# Altium project Twintig-FFC-Metacarpal-RA.PrjPcb
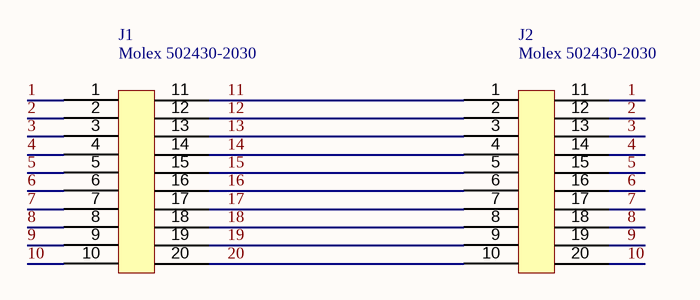
[diagram p0: Twintig-FFC-Metacarpal-RA.SchDoc]
Version: v1.0.2; Project: Twintig FCC Metacarpal RA; Author: Seb Madgwick
1 sheet, 2 parts. Net scope: global (net labels, ports and power ports of the same name join across sheets).
Board file: Twintig-FFC-Metacarpal-RA.PcbDoc

## Sheet Twintig-FFC-Metacarpal-RA.SchDoc
size A4; SheetNumber: 1; SheetTotal: 1

### Parts
J1  Molex 502430-2030  [Molex 502430-2030]
J2  Molex 502430-2030  [Molex 502430-2030]

### Nets
1: J1.1 J2.11
2: J1.2 J2.12
3: J1.3 J2.13
4: J1.4 J2.14
5: J1.5 J2.15
6: J1.6 J2.16
7: J1.7 J2.17
8: J1.8 J2.18
9: J1.9 J2.19
10: J1.10 J2.20
11: J1.11 J2.1
12: J1.12 J2.2
13: J1.13 J2.3
14: J1.14 J2.4
15: J1.15 J2.5
16: J1.16 J2.6
17: J1.17 J2.7
18: J1.18 J2.8
19: J1.19 J2.9
20: J1.20 J2.10

### Notes on the sheet
- TITLE
- SIZE
- A4
- VARIANT
- PROJECT
- SHEET
- VERSION
- OF
- AUTHOR
- DATE